# Altium schematic sheet Connectors.SchDoc
size A4
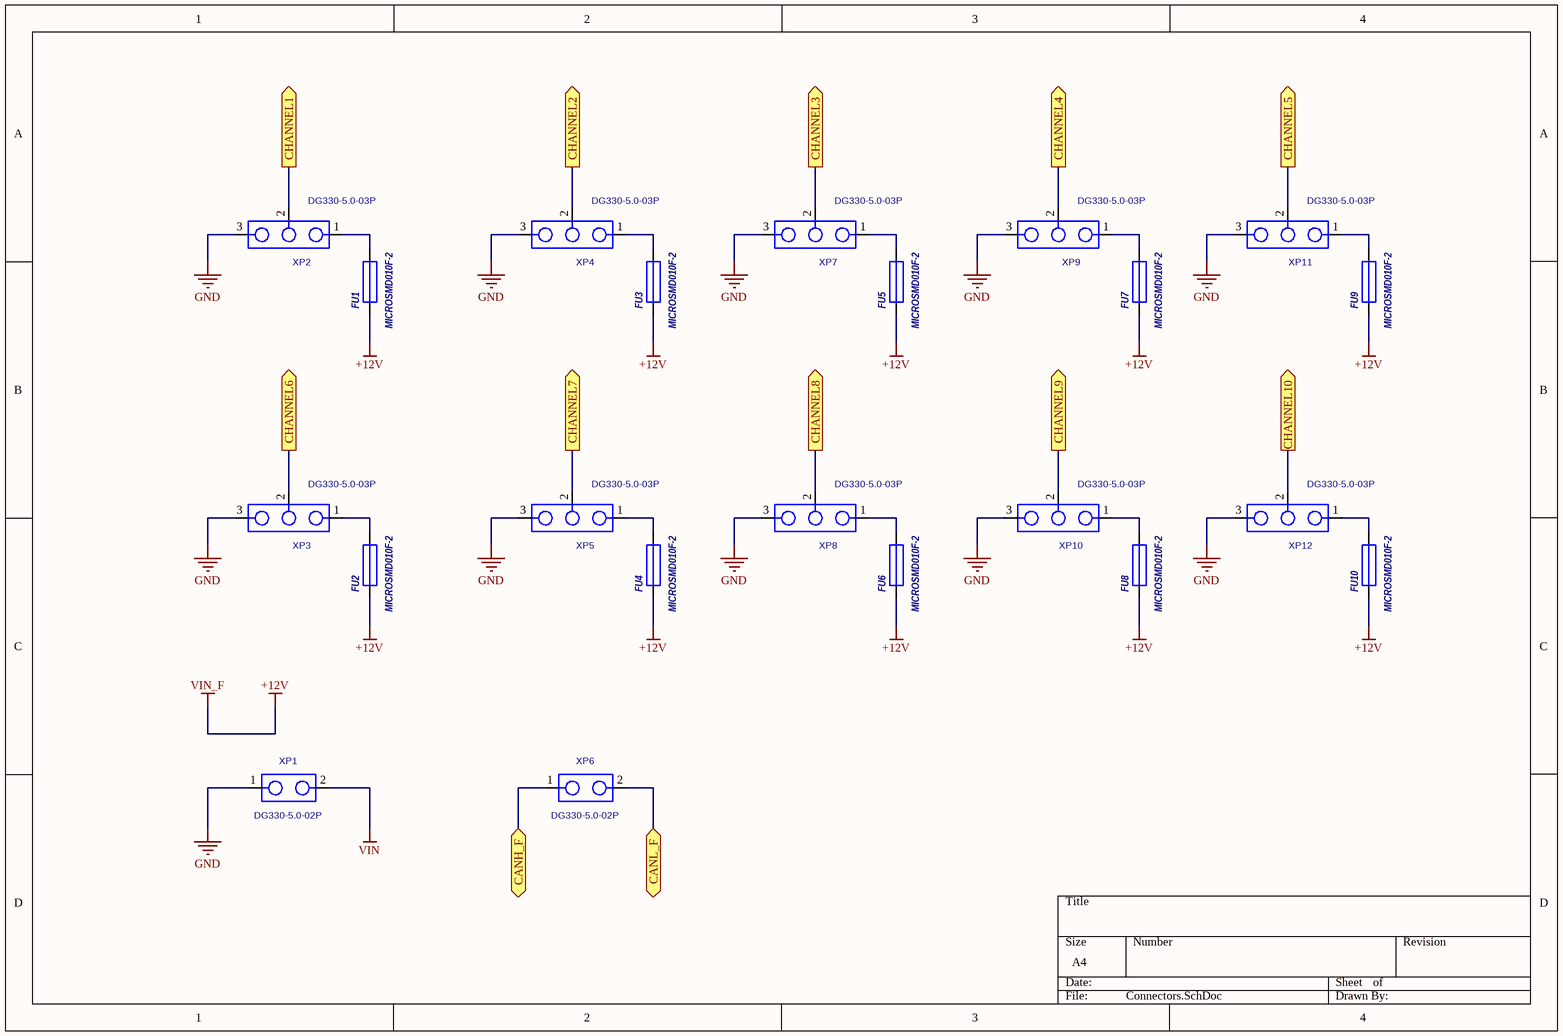
[diagram p0: Connectors.SchDoc]

## Parts
FU1  MICROSMD010F-2  [RC1210]
FU2  MICROSMD010F-2  [RC1210]
FU3  MICROSMD010F-2  [RC1210]
FU4  MICROSMD010F-2  [RC1210]
FU5  MICROSMD010F-2  [RC1210]
FU6  MICROSMD010F-2  [RC1210]
FU7  MICROSMD010F-2  [RC1210]
FU8  MICROSMD010F-2  [RC1210]
FU9  MICROSMD010F-2  [RC1210]
FU10  MICROSMD010F-2  [RC1210]
XP1  DG330-5.0-02P  [330-021]
XP2  DG330-5.0-03P  [DG330-5.0-03P]
XP3  DG330-5.0-03P  [DG330-5.0-03P]
XP4  DG330-5.0-03P  [DG330-5.0-03P]
XP5  DG330-5.0-03P  [DG330-5.0-03P]
XP6  DG330-5.0-02P  [330-021]
XP7  DG330-5.0-03P  [DG330-5.0-03P]
XP8  DG330-5.0-03P  [DG330-5.0-03P]
XP9  DG330-5.0-03P  [DG330-5.0-03P]
XP10  DG330-5.0-03P  [DG330-5.0-03P]
XP11  DG330-5.0-03P  [DG330-5.0-03P]
XP12  DG330-5.0-03P  [DG330-5.0-03P]

## Ports
CANH_F (bidir), CANL_F (bidir), CHANNEL1 (out), CHANNEL2 (out), CHANNEL3 (out), CHANNEL4 (out), CHANNEL5 (out), CHANNEL6 (out), CHANNEL7 (out), CHANNEL8 (out), CHANNEL9 (out), CHANNEL10 (out)

## Nets
+12V: FU1.1 FU2.1 FU3.1 FU4.1 FU5.1 FU6.1 FU7.1 FU8.1 FU9.1 FU10.1  [also labelled VIN_F]
GND: XP1.1 XP2.3 XP3.3 XP4.3 XP5.3 XP7.3 XP8.3 XP9.3 XP10.3 XP11.3 XP12.3
VIN: XP1.2
CANH_F: XP6.1 ; port CANH_F
CANL_F: XP6.2 ; port CANL_F
CHANNEL1: XP2.2 ; port CHANNEL1
CHANNEL2: XP4.2 ; port CHANNEL2
CHANNEL3: XP7.2 ; port CHANNEL3
CHANNEL4: XP9.2 ; port CHANNEL4
CHANNEL5: XP11.2 ; port CHANNEL5
CHANNEL6: XP3.2 ; port CHANNEL6
CHANNEL7: XP5.2 ; port CHANNEL7
CHANNEL8: XP8.2 ; port CHANNEL8
CHANNEL9: XP10.2 ; port CHANNEL9
CHANNEL10: XP12.2 ; port CHANNEL10
NetFU1_2: FU1.2 XP2.1
NetFU2_2: FU2.2 XP3.1
NetFU3_2: FU3.2 XP4.1
NetFU4_2: FU4.2 XP5.1
NetFU5_2: FU5.2 XP7.1
NetFU6_2: FU6.2 XP8.1
NetFU7_2: FU7.2 XP9.1
NetFU8_2: FU8.2 XP10.1
NetFU9_2: FU9.2 XP11.1
NetFU10_2: FU10.2 XP12.1

## Library data of the parts
FU1-FU10 = MICROSMD: Value: MICROSMD010F-2
XP1 XP6 = DG330-5.0-02P: Value: *
XP2-XP5 XP7-XP12 = DG330-5.0-03P: Value: DG330-5.0-03P